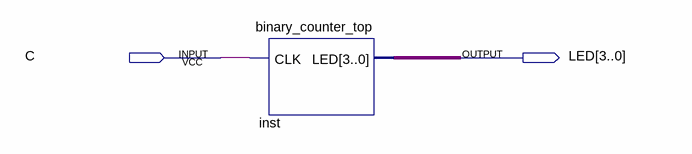
[diagram p0: schematic sheet]
// Quartus schematic lab13_5.bdf as structural Verilog: 1 symbols, 2 pins
module lab13_5 (
  input  C,
  output [3:0] LED
);

  binary_counter_top inst (.CLK(C), .LED(LED));
endmodule
